# EAGLE design Radio_TEA5767 (EAGLE 9.6.2)
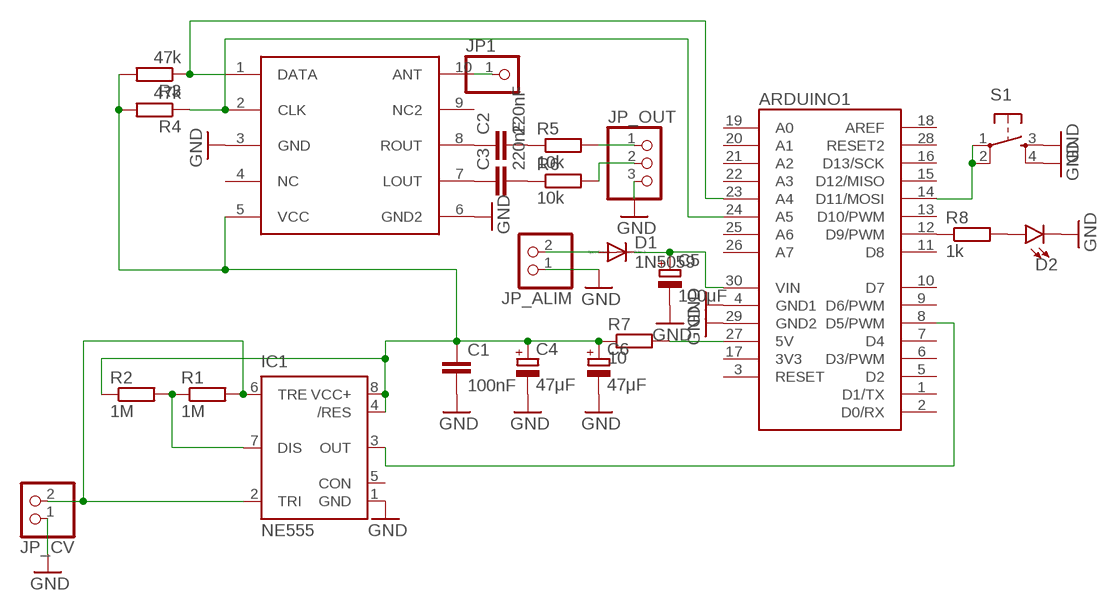
[diagram p0: schematic, sheet 1]

## Parts
ARDUINO1  ARDUINO_NANO  [ARDUINO_NANO]
C1  100nF  C-EU025-025X050  [C025-025X050]
C2  220nF  C-EU050-030X075  [C050-030X075]
C3  220nF  C-EU050-030X075  [C050-030X075]
C4  47μF  CPOL-EUE2.5-7  [E2,5-7]
C5  100μF  CPOL-EUE2.5-7  [E2,5-7]
C6  47μF  CPOL-EUE2.5-7  [E2,5-7]
D1  1N5059  [DO204-10]
D2  LED3MM  [LED_3MM]
IC1  NE555  [DIL-08]
JP1  PINHD-1X1  [1X01]
JP_ALIM  PINHD-1X2  [1X02]
JP_CV  PINHD-1X2  [1X02]
JP_OUT  PINHD-1X3  [1X03]
R1  1M  R-EU_0207/10  [0207/10]
R2  1M  R-EU_0207/10  [0207/10]
R3  47k  R-EU_0207/10  [0207/10]
R4  47k  R-EU_0207/10  [0207/10]
R5  10k  R-EU_0207/10  [0207/10]
R6  10k  R-EU_0207/10  [0207/10]
R7  10  R-EU_0207/10  [0207/10]
R8  1k  R-EU_0207/10  [0207/10]
S1  TAC_SWITCHPTH  [TACTILE-PTH]
U$1  TEA5767  [RDA]

## Nets
GND: ARDUINO1.4(GND1) ARDUINO1.29(GND2) C1.2 C4.- C5.- C6.- D2.K(C) IC1.1(GND) JP_ALIM.1 JP_CV.1 JP_OUT.3 S1.3 S1.4 U$1.3(GND) U$1.6(GND2)
N$1: IC1.2(TRI) IC1.6(TRE) JP_CV.2 R1.2
N$2: IC1.7(DIS) R1.1 R2.2
N$3: C2.1 U$1.8(ROUT)
N$4: JP1.1 U$1.10(ANT)
N$5: ARDUINO1.30(VIN) C5.+ D1.C
N$6: ARDUINO1.24(A5) R4.1 U$1.2(CLK)
N$7: C1.1 C4.+ C6.+ IC1.4(/RES) IC1.8(VCC+) R2.1 R3.2 R4.2 R7.1 U$1.5(VCC)
N$8: C2.2 R5.1
N$9: JP_OUT.1 R5.2
N$10: JP_OUT.2 R6.2
N$11: C3.1 U$1.7(LOUT)
N$12: C3.2 R6.1
N$13: ARDUINO1.23(A4) R3.1 U$1.1(DATA)
N$14: ARDUINO1.12(D9/PWM) R8.1
N$15: ARDUINO1.14(D11/MOSI) S1.1 S1.2
N$16: ARDUINO1.27(5V) R7.2
N$17: D2.A R8.2
N$20: ARDUINO1.8(D5/PWM) IC1.3(OUT)
N$21: D1.A JP_ALIM.2
Unconnected: ARDUINO1.1(D1/TX) ARDUINO1.2(D0/RX) ARDUINO1.3(RESET) ARDUINO1.5(D2) ARDUINO1.6(D3/PWM) ARDUINO1.7(D4) ARDUINO1.9(D6/PWM) ARDUINO1.10(D7) ARDUINO1.11(D8) ARDUINO1.13(D10/PWM) ARDUINO1.15(D12/MISO) ARDUINO1.16(D13/SCK) ARDUINO1.18(AREF) ARDUINO1.19(A0) ARDUINO1.20(A1) ARDUINO1.21(A2) ARDUINO1.22(A3) ARDUINO1.25(A6) ARDUINO1.26(A7) IC1.5(CON) U$1.4(NC) U$1.9(NC2)

## Power pins joined to a net without a drawn wire
3V3: ARDUINO1.17(3V3)
RESET2: ARDUINO1.28(RESET2)

## Library data of the parts
ARDUINO1 = arduino:ARDUINO_NANO: Arduino Nano I/O pin arrangement
C1-C3 = rcl:C-EU: CAPACITOR, European symbol; SPICEPREFIX: C
C4-C6 = rcl:CPOL-EU: POLARIZED CAPACITOR, European symbol; SPICEPREFIX: C
D1 = diode:1N5059: DIODE controlled avalanche rectifier
D2 = SparkFun-LED:LED: LED (Generic) Standard schematic elements and footprints for 5mm, 3mm, 1206, and 0603 sized LEDs. Generic LEDs with no color specified.; PROD_ID: DIO-08794
IC1 = st-microelectronics:NE555: General purpose bipolar Timer; MF: Arrow Electronics; MPN: NE555N; OC_FARNELL: 1467742; OC_NEWARK: 89K1486
JP1 = pinhead:PINHD-1X1: PIN HEADER
JP_ALIM JP_CV = pinhead:PINHD-1X2: PIN HEADER
JP_OUT = pinhead:PINHD-1X3: PIN HEADER
R1-R8 = rcl:R-EU_: RESISTOR, European symbol; SPICEPREFIX: R
S1 = SparkFun-Retired:TAC_SWITCH: Momentary Switch Button commonly used for reset or general input. Spark Fun Electronics SKU : COM-00097 SMT- SWCH-08247
U$1 = tea5767:TEA5767

## Board
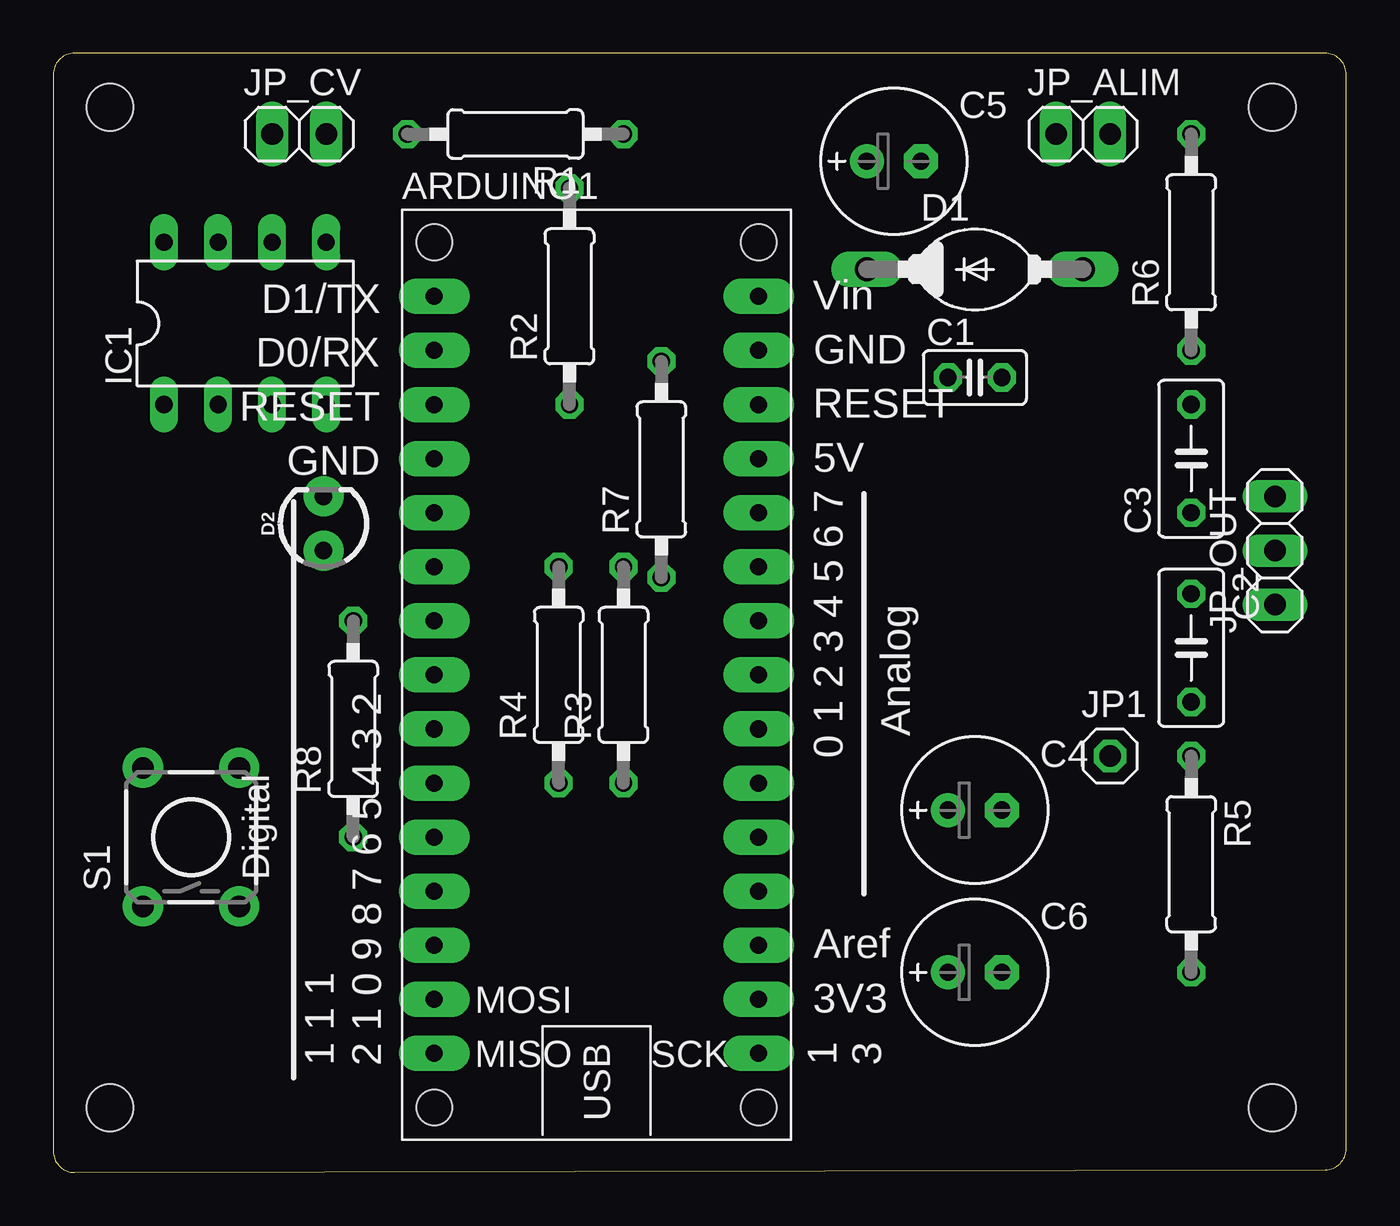
[diagram p1: board, top side]
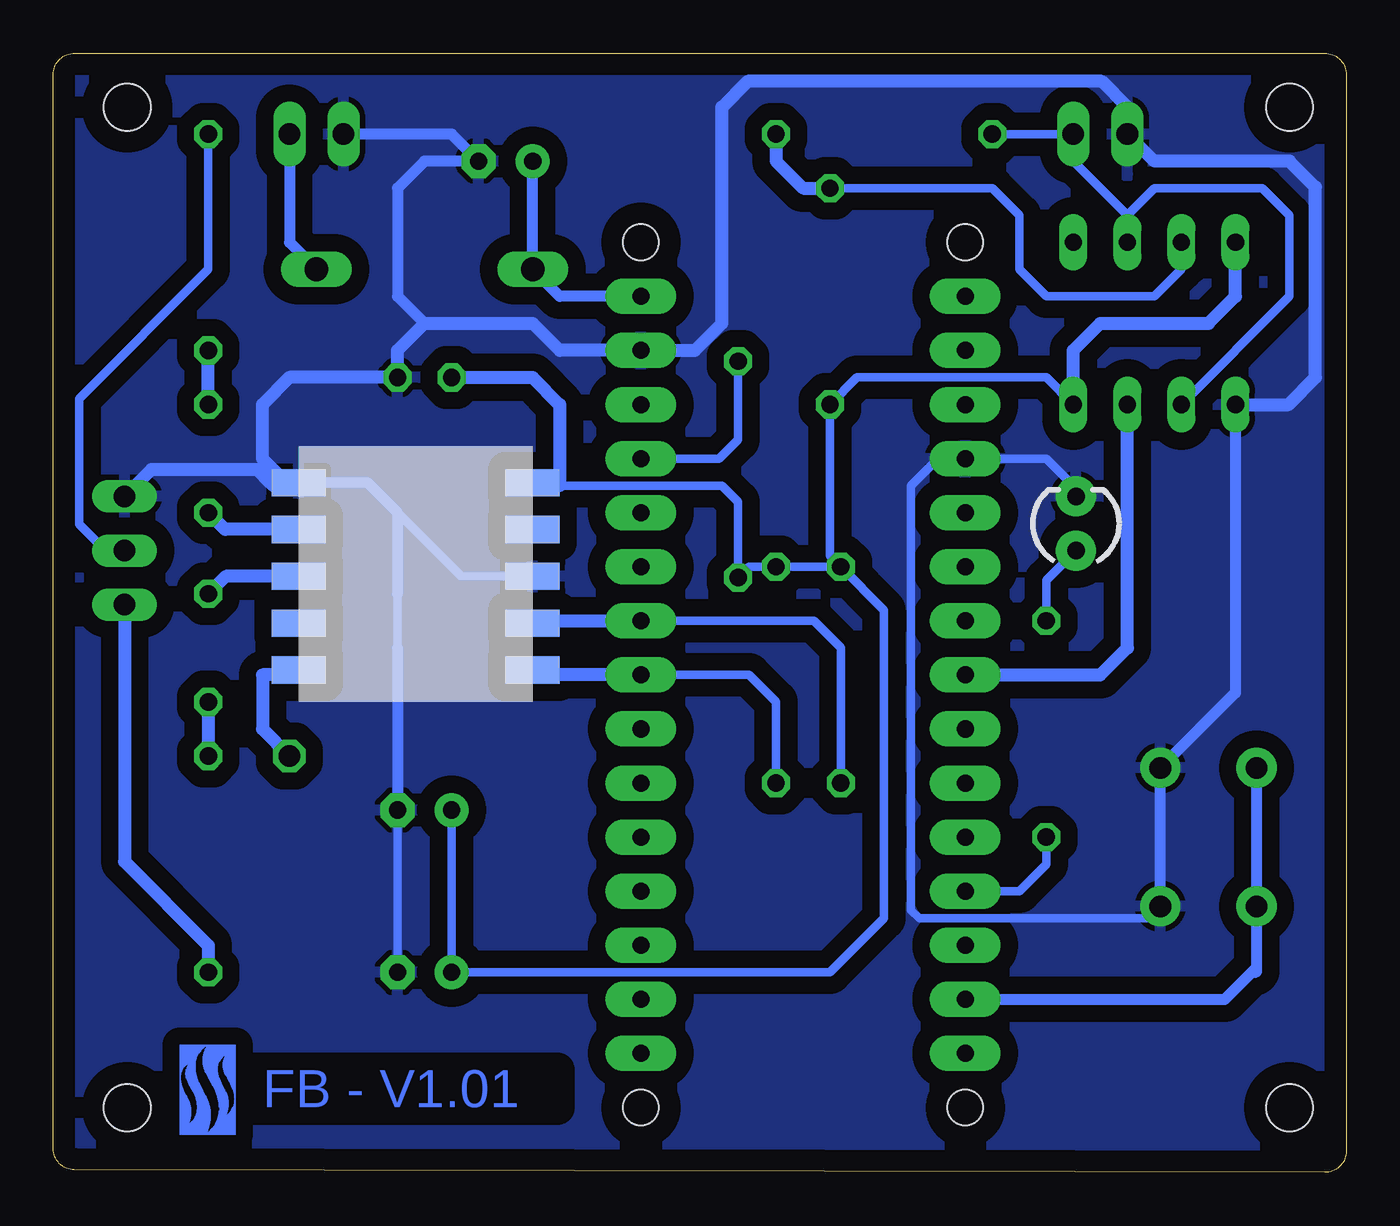
[diagram p2: board, bottom side, seen from below]

Size 60.76 x 52.57 mm. Coordinates in mm from the lower left corner, seen from the top.
Outline: 0,51.57 0,1 arc90 1,0 59.76,0.12 arc90 60.76,1.12 60.76,51.57 arc90 59.76,52.57 1,52.57 arc90 0,51.57
Copper layers (1*16): Top 0.035mm / dielectric 1.5mm / Bottom 0.035mm
Design rules "default": minimum track width 6mil, minimum drill 0.35mm, track to track 6mil, track to pad 6mil, pad to pad 6mil, via to via 6mil, smd to smd 6mil, copper to edge 40mil, drill to drill 6mil, minimum pad ring 10mil, minimum via ring 8mil, stop-mask expansion 4mil, vias tented up to drill 0mil, thermal gap 10mil
Holes 2.2 mm at 2.67,50.04 2.67,3.05 57.28,3.05 57.28,50.04

### Footprints (pad centres in the part's own frame; a part is rotated, then mirrored left to right if it is on the bottom)
ARDUINO_NANO = drill 0.8 pad 1.676 long: 1 0,-2.54; 2 0,-5.08; 3 0,-7.62; 4 0,-10.16; 5 0,-12.7; 6 0,-15.24; 7 0,-17.78; 8 0,-20.32; 9 0,-22.86; 10 0,-25.4; 11 0,-27.94; 12 0,-30.48; 13 0,-33.02; 14 0,-35.56; 15 0,-38.1; 16 15.24,-38.1; 17 15.24,-35.56; 18 15.24,-33.02; 19 15.24,-30.48; 20 15.24,-27.94; 21 15.24,-25.4; 22 15.24,-22.86; 23 15.24,-20.32; 24 15.24,-17.78; 25 15.24,-15.24; 26 15.24,-12.7; 27 15.24,-10.16; 28 15.24,-7.62; 29 15.24,-5.08; 30 15.24,-2.54 | hole 1.676: 0,0; 0,-40.64; 15.24,-40.64; 15.24,0
C025-025X050 = drill 0.813 octagon: 1 -1.27,0; 2 1.27,0
C050-030X075 = drill 0.813 octagon: 1 -2.54,0; 2 2.54,0
E2,5-7 = drill 0.813 pad 1.6: + -1.27,0 | drill 0.813 pad 1.6 octagon: - 1.27,0
DO204-10 = drill 1.118 long: A 5.08,0; C -5.08,0
LED_3MM = drill 0.813 pad 1.88: A -1.27,0; K 1.27,0
DIL-08 = drill 0.813 long: 1 -3.81,-3.81; 2 -1.27,-3.81; 3 1.27,-3.81; 4 3.81,-3.81; 5 3.81,3.81; 6 1.27,3.81; 7 -1.27,3.81; 8 -3.81,3.81
1X01 = drill 1.016 octagon: 1 0,0
1X02 = drill 1.016 long: 1 -1.27,0; 2 1.27,0
1X03 = drill 1.016 long: 1 -2.54,0; 2 0,0; 3 2.54,0
0207/10 = drill 0.813 octagon: 1 -5.08,0; 2 5.08,0
TACTILE-PTH = drill 1.016 pad 1.88: 1 -3.251,2.261; 2 3.251,2.261; 3 -3.251,-2.261; 4 3.251,-2.261
RDA = smd 2.54 x 1.27: 1 0,-1.5; 2 0,-3.7; 3 0,-5.9; 4 0,-8.1; 5 0,-10.3; 6 11,-10.3; 7 11,-8.1; 8 11,-5.9; 9 11,-3.7; 10 11,-1.5

### Placement (x,y rotation side)
ARDUINO1  17.91,43.69 0 top
C1  43.31,37.34 0 top
C2  53.47,24.64 270 top
C3  53.47,33.53 90 top
C4  43.31,17.02 0 top
C5  39.5,47.5 0 top
C6  43.31,9.4 0 top
D1  43.31,42.42 0 top
D2  12.7,30.48 90 top
IC1  9.02,39.88 0 top
JP1  49.66,19.56 0 top
JP_ALIM  48.39,48.77 0 top
JP_CV  11.56,48.77 0 top
JP_OUT  57.4,29.21 90 top
R1  21.72,48.77 180 top
R2  24.26,41.15 90 top
R3  26.8,23.37 90 top
R4  23.75,23.37 90 top
R5  53.47,14.48 270 top
R6  53.47,43.69 90 top
R7  28.57,33.02 90 top
R8  14.1,20.83 90 top
S1  6.48,15.75 90 top
U$1  38.23,22.1 180 bottom
U$2  [FB]  52.2,1.78 0 top

### Tracks (layer width: path | path; a pad name or v marks a point on that pad's centre or on a via)
GND
  Bottom 0.406: 44.58,27.18 44.58,24.64 | U$1.3 41.59,28 44.58,30.99 | C4.- C6.- | S1.3 9.3,11.94 20.07,11.94 20.45,12.32 20.45,32.26 19.18,33.53 ARDUINO1.4 14.1,33.53 12.7,32.13 D2.K
  Bottom 0.508: JP_ALIM.1 42.04,48.77 C5.- 43.31,47.5 44.58,46.23 44.58,41.15 43.31,39.88 | S1.3 S1.4 5.21,22.53 IC1.1 | 44.58,24.64 C4.- | 44.58,27.18 44.58,30.99 45.99,32.4 U$1.6
  Bottom 0.61: IC1.1 2.72,36.07 1.45,37.34 1.45,46.28 2.67,47.5 9.02,47.5 JP_CV.1 10.29,50.04 11.5,51.24 28.13,51.24 29.34,50.04 29.34,39.88 30.61,38.61 ARDUINO1.29 36.96,38.61 38.23,39.88 43.31,39.88 44.58,38.61 C1.2 49.66,37.34 50.93,36.07 50.93,33.53 49.8,32.4 | JP_OUT.3 56.13,33.02 51.18,33.02 50.56,32.4 | 50.56,32.4 50.42,32.26 | U$1.6 49.8,32.4 | 50.56,32.4 49.8,32.4
  pour Bottom (isolate 0.813): 0.13,52.58 61.09,52.58 61.09,0.51 0.13,0.51
N$1
  Bottom 0.406: 10.29,44.96 9.02,46.23 3.94,46.23 2.67,44.96 2.67,41.15 IC1.2 | IC1.6 10.29,44.96 | 10.29,44.96 12.83,47.5 JP_CV.2 R1.2
N$2
  Bottom 0.406: IC1.7 7.75,42.42 9.02,41.15 14.1,41.15 15.37,42.42 15.37,44.96 16.64,46.23 R2.2
  Bottom 0.61: R1.1 26.8,47.5 25.53,46.23 R2.2
N$3
  Bottom 0.61: U$1.8 52.65,28 C2.1
N$4
  Bottom 0.61: U$1.10 49.46,23.37 50.93,23.37 50.93,20.83 JP1.1
N$5
  Bottom 0.508: ARDUINO1.30 36.96,41.15 D1.C C5.+
N$6
  Bottom 0.406: R4.1 23.75,24.64 25.02,25.91 ARDUINO1.24
  Bottom 0.61: U$1.2 38.12,25.91 ARDUINO1.24
N$7
  Bottom 0.406: IC1.4 14.1,37.34 22.99,37.34 R2.1 24.26,28.95 R4.2 | 28.57,30.48 R7.1 | R7.1 28.57,31.49 29.34,32.26 38.09,32.26 | C4.+ C6.+ 24.26,9.4 21.72,11.94 21.72,26.41 R4.2 | R7.1 28.07,28.45 R3.2 R4.2
  Bottom 0.61: IC1.4 12.83,38.61 11.56,39.88 6.48,39.88 5.21,41.15 IC1.8 | U$1.5 38.09,32.26 36.96,32.26 36.96,36.07 38.23,37.34 C1.1
N$8
  Bottom 0.61: C2.2 R5.1
N$9
  Bottom 0.61: JP_OUT.1 57.4,14.6 53.47,10.67 R5.2
N$10
  Bottom 0.406: 58.29,29.21 59.54,30.45 59.54,36.34 53.47,42.42 R6.2
  Bottom 0.61: JP_OUT.2 58.29,29.21
N$11
  Bottom 0.61: U$1.7 52.68,30.2 C3.1
N$12
  Bottom 0.61: C3.2 R6.1
N$13
  Bottom 0.406: R3.1 26.8,22.1 28.07,23.37 ARDUINO1.23
  Bottom 0.61: ARDUINO1.23 38,23.37 U$1.1
N$14
  Bottom 0.406: ARDUINO1.12 15.37,13.21 14.1,14.48 R8.1
N$15
  Bottom 0.508: ARDUINO1.14 5.71,8.13 4.34,9.5 4.28,9.38 4.22,9.45 S1.1 S1.2
N$16
  Bottom 0.406: ARDUINO1.27 29.46,33.53 28.57,34.41 R7.2
N$17
  Bottom 0.406: D2.A 14.1,27.81 R8.2
N$20
  Bottom 0.61: ARDUINO1.8 11.56,23.37 10.29,24.64 IC1.3
N$21
  Bottom 0.508: JP_ALIM.2 49.66,43.69 D1.A

### Text on the board
Bottom: FB - V1.01